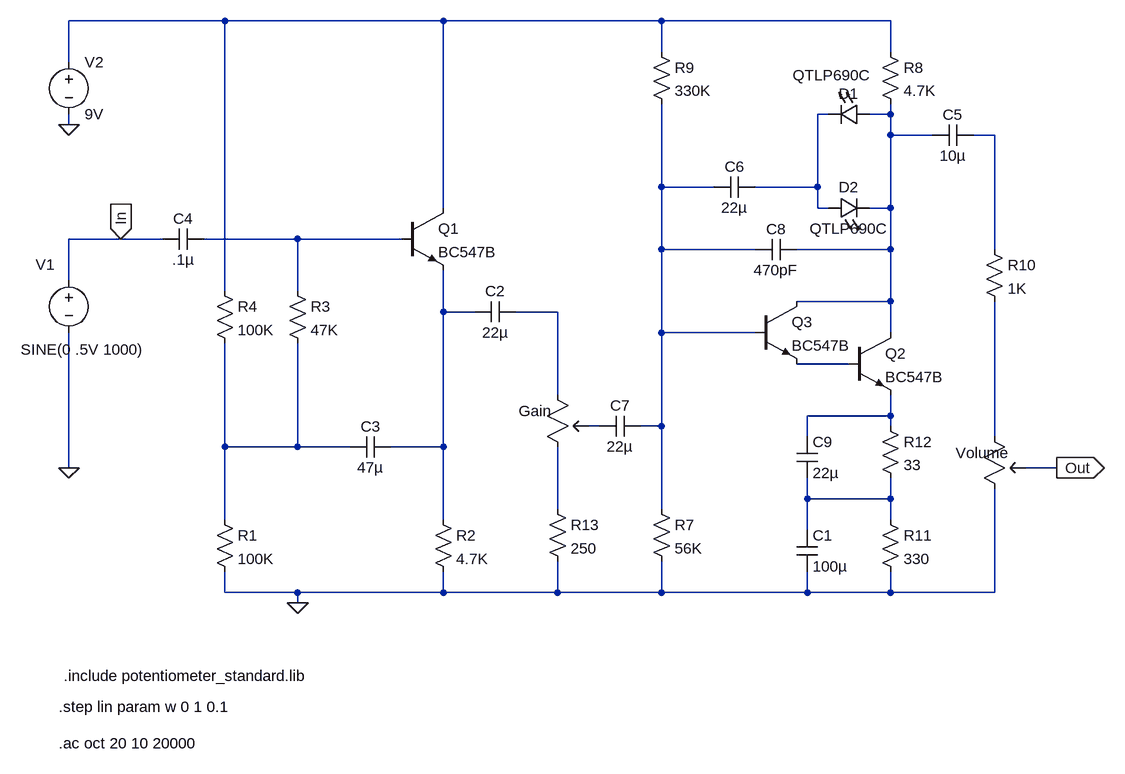
[diagram p0: schematic bjt screamer npn darlington freq.asc]
bjt screamer npn darlington freq.asc, the LTspice schematic file:
Version 4
SHEET 1 880 680
WIRE -1184 -1024 -1424 -1024
WIRE -848 -1024 -1184 -1024
WIRE -512 -1024 -848 -1024
WIRE -160 -1024 -512 -1024
WIRE -512 -976 -512 -1024
WIRE -160 -976 -160 -1024
WIRE -1424 -960 -1424 -1024
WIRE -256 -880 -272 -880
WIRE -160 -880 -160 -896
WIRE -160 -880 -192 -880
WIRE -1424 -864 -1424 -880
WIRE -160 -848 -160 -880
WIRE -96 -848 -160 -848
WIRE 0 -848 -32 -848
WIRE -512 -768 -512 -896
WIRE -432 -768 -512 -768
WIRE -272 -768 -272 -880
WIRE -272 -768 -368 -768
WIRE -848 -736 -848 -1024
WIRE -272 -736 -272 -768
WIRE -256 -736 -272 -736
WIRE -160 -736 -160 -848
WIRE -160 -736 -192 -736
WIRE -1344 -688 -1424 -688
WIRE -1280 -688 -1344 -688
WIRE -1072 -688 -1216 -688
WIRE -912 -688 -1072 -688
WIRE -512 -672 -512 -768
WIRE -368 -672 -512 -672
WIRE -160 -672 -160 -736
WIRE -160 -672 -304 -672
WIRE 0 -672 0 -848
WIRE -1424 -624 -1424 -688
WIRE -1184 -608 -1184 -1024
WIRE -1072 -608 -1072 -688
WIRE -160 -592 -160 -672
WIRE -160 -592 -304 -592
WIRE -848 -576 -848 -640
WIRE -800 -576 -848 -576
WIRE -672 -576 -736 -576
WIRE -512 -544 -512 -672
WIRE -368 -544 -512 -544
WIRE -160 -544 -160 -592
WIRE -224 -496 -304 -496
WIRE -672 -448 -672 -576
WIRE -160 -416 -160 -448
WIRE -160 -416 -288 -416
WIRE -608 -400 -624 -400
WIRE -512 -400 -512 -544
WIRE -512 -400 -544 -400
WIRE -160 -400 -160 -416
WIRE -288 -384 -288 -416
WIRE 0 -384 0 -592
WIRE -1184 -368 -1184 -528
WIRE -1072 -368 -1072 -528
WIRE -1072 -368 -1184 -368
WIRE -992 -368 -1072 -368
WIRE -848 -368 -848 -576
WIRE -848 -368 -928 -368
WIRE -1424 -336 -1424 -544
WIRE 96 -336 48 -336
WIRE -288 -288 -288 -320
WIRE -160 -288 -160 -320
WIRE -160 -288 -288 -288
WIRE -672 -272 -672 -368
WIRE -512 -272 -512 -400
WIRE -1184 -256 -1184 -368
WIRE -848 -256 -848 -368
WIRE -160 -256 -160 -288
WIRE -288 -240 -288 -288
WIRE -1184 -144 -1184 -176
WIRE -1072 -144 -1184 -144
WIRE -848 -144 -848 -176
WIRE -848 -144 -1072 -144
WIRE -672 -144 -672 -192
WIRE -672 -144 -848 -144
WIRE -512 -144 -512 -192
WIRE -512 -144 -672 -144
WIRE -288 -144 -288 -176
WIRE -288 -144 -512 -144
WIRE -160 -144 -160 -176
WIRE -160 -144 -288 -144
WIRE 0 -144 0 -304
WIRE 0 -144 -160 -144
WIRE -1072 -128 -1072 -144
FLAG -1424 -336 0
FLAG -1424 -864 0
FLAG -1072 -128 0
FLAG 96 -336 Out
IOPIN 96 -336 Out
FLAG -1344 -688 In
IOPIN -1344 -688 In
SYMBOL voltage -1424 -640 R0
WINDOW 39 -112 95 Left 2
WINDOW 3 -74 122 Left 2
WINDOW 0 -51 -9 Left 2
SYMATTR Value SINE(0 .5V 1000)
SYMATTR InstName V1
SYMATTR Value2 AC 1
SYMBOL voltage -1424 -976 R0
WINDOW 123 0 0 Left 2
WINDOW 39 24 -12 Left 2
SYMATTR InstName V2
SYMATTR Value 9V
SYMBOL res -1200 -272 R0
SYMATTR InstName R1
SYMATTR Value 100K
SYMBOL cap -736 -592 R90
WINDOW 0 0 32 VBottom 2
WINDOW 3 32 32 VTop 2
SYMATTR InstName C2
SYMATTR Value 22µ
SYMBOL res -864 -272 R0
SYMATTR InstName R2
SYMATTR Value 4.7K
SYMBOL cap -928 -384 R90
WINDOW 0 0 32 VBottom 2
WINDOW 3 32 32 VTop 2
SYMATTR InstName C3
SYMATTR Value 47µ
SYMBOL res -1088 -624 R0
SYMATTR InstName R3
SYMATTR Value 47K
SYMBOL res -1200 -624 R0
SYMATTR InstName R4
SYMATTR Value 100K
SYMBOL cap -1216 -704 R90
WINDOW 0 0 32 VBottom 2
WINDOW 3 32 32 VTop 2
SYMATTR InstName C4
SYMATTR Value .1µ
SYMBOL potentiometer_standard -688 -464 R0
WINDOW 0 -44 41 Left 2
WINDOW 3 -201 26 Invisible 2
SYMATTR InstName Gain
SYMATTR Value Rtot=10K wiper={w}
SYMATTR SpiceModel pot_lin
SYMBOL res -176 -992 R0
SYMATTR InstName R8
SYMATTR Value 4.7K
SYMBOL res -176 -272 R0
SYMATTR InstName R11
SYMATTR Value 330
SYMBOL cap -32 -864 R90
WINDOW 0 0 32 VBottom 2
WINDOW 3 32 32 VTop 2
SYMATTR InstName C5
SYMATTR Value 10µ
SYMBOL cap -304 -240 R0
SYMATTR InstName C1
SYMATTR Value 100µ
SYMBOL npn -912 -736 R0
SYMATTR InstName Q1
SYMATTR Value BC547B
SYMBOL npn -368 -592 R0
SYMATTR InstName Q3
SYMATTR Value BC547B
SYMBOL res -528 -992 R0
SYMATTR InstName R9
SYMATTR Value 330K
SYMBOL res -528 -288 R0
SYMATTR InstName R7
SYMATTR Value 56K
SYMBOL cap -368 -784 R90
WINDOW 0 0 32 VBottom 2
WINDOW 3 32 32 VTop 2
SYMATTR InstName C6
SYMATTR Value 22µ
SYMBOL LED -192 -896 R90
WINDOW 0 0 32 VBottom 2
WINDOW 3 -60 58 VTop 2
SYMATTR InstName D1
SYMATTR Value QTLP690C
SYMATTR Description Diode
SYMATTR Type diode
SYMBOL LED -256 -720 R270
WINDOW 0 32 32 VTop 2
WINDOW 3 0 32 VBottom 2
SYMATTR InstName D2
SYMATTR Value QTLP690C
SYMATTR Description Diode
SYMATTR Type diode
SYMBOL cap -544 -416 R90
WINDOW 0 0 32 VBottom 2
WINDOW 3 32 32 VTop 2
SYMATTR InstName C7
SYMATTR Value 22µ
SYMBOL res -16 -688 R0
SYMATTR InstName R10
SYMATTR Value 1K
SYMBOL cap -304 -688 R90
WINDOW 0 0 32 VBottom 2
WINDOW 3 32 32 VTop 2
SYMATTR InstName C8
SYMATTR Value 470pF
SYMBOL res -688 -288 R0
SYMATTR InstName R13
SYMATTR Value 250
SYMBOL potentiometer_standard -16 -400 R0
WINDOW 0 -44 41 Left 2
WINDOW 3 -201 26 Invisible 2
SYMATTR InstName Volume
SYMATTR Value Rtot=10K wiper=1
SYMATTR SpiceModel pot_lin
SYMBOL res -176 -416 R0
SYMATTR InstName R12
SYMATTR Value 33
SYMBOL cap -304 -384 R0
SYMATTR InstName C9
SYMATTR Value 22µ
SYMBOL npn -224 -544 R0
SYMATTR InstName Q2
SYMATTR Value BC547B
TEXT -1432 -16 Left 2 !.include potentiometer_standard.lib
TEXT -1440 32 Left 2 !.step lin param w 0 1 0.1
TEXT -1440 88 Left 2 !.ac oct 20 10 20000

The netlist it stands for:
* bjt screamer npn darlington freq.asc
V1 In 0 SINE(0 .5V 1000) AC 1
V2 N001 0 9V
R1 N013 0 100K
C2 N008 N007 22µ
R2 N007 0 4.7K
C3 N007 N013 47µ
R3 N006 N013 47K
R4 N001 N013 100K
C4 N006 In .1µ
XGain N008 N015 N011 pot_lin Rtot=10K wiper={w}  ; pins A B C
R8 N001 N003 4.7K
R11 N014 0 330
C5 N004 N003 10µ
C1 N014 0 100µ
Q1 N001 N006 N007 0 BC547B
Q3 N003 N005 N009 0 BC547B
R9 N001 N005 330K
R7 N005 0 56K
C6 N002 N005 22µ
D1 N003 N002 QTLP690C
D2 N002 N003 QTLP690C
C7 N005 N011 22µ
R10 N004 N012 1K
C8 N003 N005 470pF
R13 N015 0 250
XVolume N012 0 Out pot_lin Rtot=10K wiper=1  ; pins A B C
R12 N010 N014 33
C9 N010 N014 22µ
Q2 N003 N009 N010 0 BC547B
.model D D
.lib standard.dio
.model NPN NPN
.model PNP PNP
.lib standard.bjt
.include potentiometer_standard.lib
.step lin param w 0 1 0.1
.ac oct 20 10 20000
.backanno
.end